# Altium schematic sheet MCU.SchDoc
size 250 x 219 mm; SheetNumber: 7; SheetTotal: 7; ENG_APP_DATE: --/--/--; DSN_APP_DATE: --/--/--; CHK_APP_DATE: --/--/--
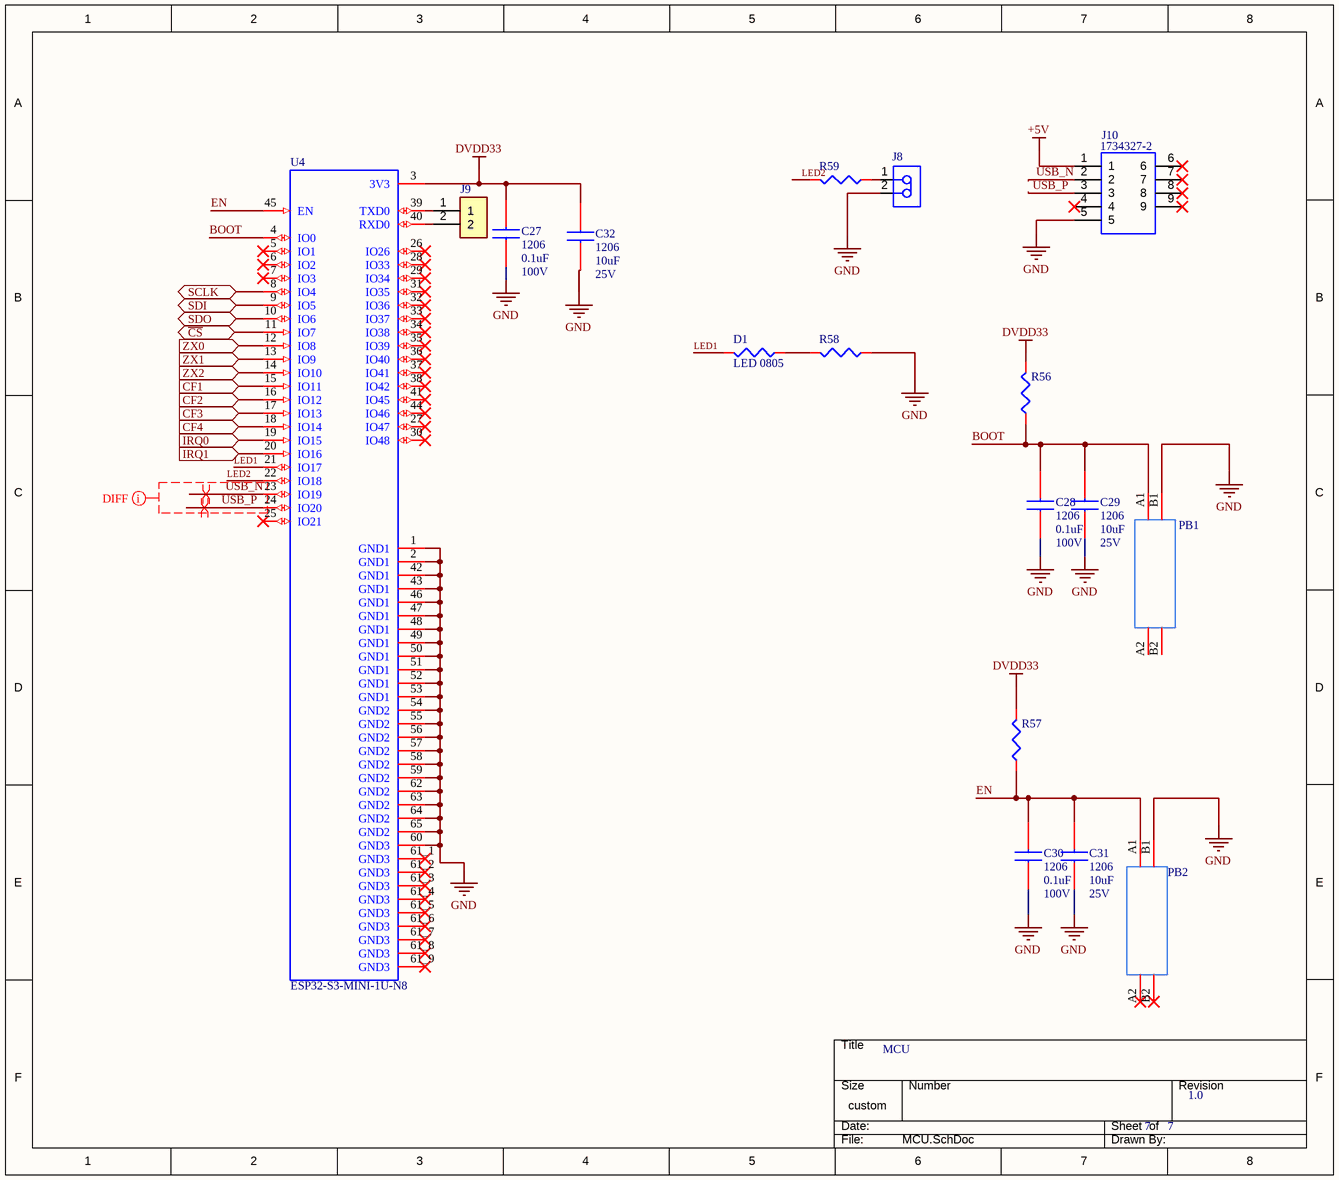
[diagram p0: MCU.SchDoc]

## Parts
C27  Size: 1206  Capacitance: 0.1uF  Voltage: 100V  [CAPC3316X180N]  (hidden comment: C1206C104J1RACAUTO)
C28  Size: 1206  Capacitance: 0.1uF  Voltage: 100V  [CAPC3316X180N]  (hidden comment: C1206C104J1RACAUTO)
C29  Size: 1206  Capacitance: 10uF  Voltage: 25V  [CAPC3316X180N]  (hidden comment: MBAST31LAB7106KTNA01)
C30  Size: 1206  Capacitance: 0.1uF  Voltage: 100V  [CAPC3316X180N]  (hidden comment: C1206C104J1RACAUTO)
C31  Size: 1206  Capacitance: 10uF  Voltage: 25V  [CAPC3316X180N]  (hidden comment: MBAST31LAB7106KTNA01)
C32  Size: 1206  Capacitance: 10uF  Voltage: 25V  [CAPC3316X180N]  (hidden comment: MBAST31LAB7106KTNA01)
D1  LED 0805  [RESC2013X84N]
J8  B2B-PH-K-S(LF)(SN)  [JST-B2B-PH-K-S_V]  (value not drawn)
J9  HTSW-102-07-G-S  [HDRV2W64P0X254_1X2_508X248X838P]  (value not drawn)
J10  1734327-2  [17343272]
PB1  EVP-BV2C3L000  [EVPBV2C3L000]  (value not drawn)
PB2  EVP-BV2C3L000  [EVPBV2C3L000]  (value not drawn)
R56  ERA-6AED102V  [RESC2013X84N]  (value not drawn)
R57  ERA-6AED102V  [RESC2013X84N]  (value not drawn)
R58  ERA-6AED102V  [RESC2013X84N]  (value not drawn)
R59  ERA-6AED102V  [RESC2013X84N]  (value not drawn)
U4  ESP32-S3-MINI-1U-N8  [XCVR_ESP32-S3-MINI-1U-N8]

## Ports
CF1 (in, see Main[1B], MeteringIC[1D]), CF2 (in, see Main[1B], MeteringIC[2C]), CF3 (in, see Main[1B], MeteringIC[2C]), CF4 (in, see Main[1B], MeteringIC[2C]), IRQ0 (in, see Main[1B], MeteringIC[2C]), IRQ1 (in, see Main[1A], MeteringIC[2C]), SCLK (bidir, see Main[1B], MeteringIC[2E]), SDI (bidir, see Main[1B], MeteringIC[2E]), SDO (bidir, see Main[1B], MeteringIC[2E]), ZX0 (in, see Main[1B], MeteringIC[2D]), ZX1 (in, see Main[1B], MeteringIC[2D]), ZX2 (in, see Main[1B], MeteringIC[2D]), ~{CS} (bidir, see Main[1B], MeteringIC[2E])

## Nets
+5V: J10.1
DVDD33: C27.1 C32.1 R56.1 R57.1 U4.3(3V3)
GND: C27.2 C28.2 C29.2 C30.2 C31.2 C32.2 J8.2 J10.5 PB1.B1(NO_1) PB2.B1(NO_1) R58.2 U4.1(GND1) U4.2(GND1) U4.42(GND1) U4.43(GND1) U4.46(GND1) U4.47(GND1) U4.48(GND1) U4.49(GND1) U4.50(GND1) U4.51(GND1) U4.52(GND1) U4.53(GND1) U4.54(GND2) U4.55(GND2) U4.56(GND2) U4.57(GND2) U4.58(GND2) U4.59(GND2) U4.60(GND3) U4.62(GND2) U4.63(GND2) U4.64(GND2) U4.65(GND2)
BOOT: C28.1 C29.1 PB1.A1(COM_1) R56.2 U4.4(IO0)
~{CS}: U4.11(IO7) ; port ~{CS}
CF1: U4.15(IO11) ; port CF1
CF2: U4.16(IO12) ; port CF2
CF3: U4.17(IO13) ; port CF3
CF4: U4.18(IO14) ; port CF4
EN: C30.1 C31.1 PB2.A1(COM_1) R57.2 U4.45(EN)
IRQ0: U4.19(IO15) ; port IRQ0
IRQ1: U4.20(IO16) ; port IRQ1
LED1: D1.1 U4.21(IO17)
LED2: R59.2 U4.22(IO18)
SCLK: U4.8(IO4) ; port SCLK
SDI: U4.9(IO5) ; port SDI
SDO: U4.10(IO6) ; port SDO
USB_N: J10.2 U4.23(IO19)
USB_P: J10.3 U4.24(IO20)
ZX0: U4.12(IO8) ; port ZX0
ZX1: U4.13(IO9) ; port ZX1
ZX2: U4.14(IO10) ; port ZX2
NetD1_2: D1.2 R58.1
NetJ8_1: J8.1 R59.1
NetJ9_1: J9.1 U4.39(TXD0)
NetJ9_2: J9.2 U4.40(RXD0)

Not connected (* = marked no-connect by the designer): J10 4* 6* 7* 8* 9*; PB1 A2(COM_2) B2(NO_2); PB2 A2(COM_2)* B2(NO_2)*; U4 5(IO1)* 6(IO2)* 7(IO3)* 25(IO21)* 26(IO26)* 27(IO47)* 28(IO33)* 29(IO34)* 30(IO48)* 31(IO35)* 32(IO36)* 33(IO37)* 34(IO38)* 35(IO39)* 36(IO40)* 37(IO41)* 38(IO42)* 41(IO45)* 44(IO46)* 61_1(GND3)* 61_2(GND3)* 61_3(GND3)* 61_4(GND3)* 61_5(GND3)* 61_6(GND3)* 61_7(GND3)* 61_8(GND3)* 61_9(GND3)*

## Layout directives
differential pair: USB_N, USB_P
net class DIFF: USB_N, USB_P

## Notes on the sheet
- MCU
- 7
- 1.0
- DWG. NO.
- REV.
- SHT.
- THIS DOCUMENT AND THE DATA DISCLOSED HEREIN OR HEREWITH IS THE PROPERTY OF ALTIUM LIMITED AND MAY BE FREELY DISTRIBUTED IN WHOLE. NO RIGHTS ARE RESERVED OR EXPRESS OR IMPLIED WARANTEE GIVEN.
- REVISION
- DESCRIPTION
- DATE
- APPROVED
- ENG:
- APPROVALS
- PROJECT
- DSN:
- CHK:
- REFERENCE DOCUMENTS
- PROJECT REVISION:
- TITLE
- DOCUMENT REVISION:
- DESIGN ITEM:
- BOM:
- FAB DWG:
- PCB DWG:
- ASSY DWG:
- SCALE:
- SIZE
- B
- CAGE CODE
- FILE NAME
- DWG NO.
- SHEET
- OF
- REV

## Library data of the parts
C27 C28 C30 = C1206X224KARACAUTO: Multilayer Ceramic Capacitors MLCC - SMD/SMT 100V 0.1uF X7R 1206 5% AEC-Q200; Manufacturer_Name: KEMET; Geometry.Height: 1.8mm; Mouser Part Number: 80-C1206X224KARAUTO; Mouser Price/Stock: https://www.mouser.co.uk/ProductDetail/KEMET/C1206X224KARACAUTO?qs=zW32dvEIR3ul9TqTUrs40g%3D%3D; Manufacturer_Part_Number: C1206X224KARACAUTO; Datasheet Link: https://search.kemet.com/component-documentation/download/specsheet/C1206X224KARACAUTO
C29 C31 C32 = C1206X224KARACAUTO: Multilayer Ceramic Capacitors MLCC - SMD/SMT 25V 10uF X7R 1206 10%; Manufacturer_Name: KEMET; Geometry.Height: 1.8mm; Mouser Part Number: 80-C1206X224KARAUTO; Mouser Price/Stock: https://www.mouser.co.uk/ProductDetail/KEMET/C1206X224KARACAUTO?qs=zW32dvEIR3ul9TqTUrs40g%3D%3D; Manufacturer_Part_Number: C1206X224KARACAUTO; Datasheet Link: https://search.kemet.com/component-documentation/download/specsheet/C1206X224KARACAUTO
D1 R56 R57 = ERA-6AED102V: Thin Film Resistors - SMD 0805 1000ohms 25ppm 0.5% AEC-Q200; Manufacturer_Name: Panasonic; Geometry.Height: 0.6mm; Datasheet Link: https://industrial.panasonic.com/cdbs/www-data/pdf/RDM0000/AOA0000C307.pdf; Manufacturer_Part_Number: ERA-6AED102V; Mouser Part Number: 667-ERA-6AED102V; Mouser Price/Stock: https://www.mouser.co.uk/ProductDetail/Panasonic/ERA-6AED102V?qs=MNPzkKEzRtTAvKH%252BuMqwyg%3D%3D
J8 = CMP-2000-05162-1: Male Header, Pitch 2 mm, 1 x 2 Position, Height 6 mm, Tail Length 3.4 mm, -25 to 85 degC, RoHS, Bulk; Manufacturer: JST; Pitch: 2mm; Style/Orientation: StraightHeader/Plug; No of Positions: 2; Datasheet Version: Nov-08; Datasheet URL: http://datasheet.octopart.com/B2B-PH-K-S%28LF%29%28SN%29-JST-datasheet-8324864.pdf; Manufacturer URL: http://www.jst.com/home2.html; Type: ShroudedHeader; Termination: Crimp
J9 = HTSW-102-07-G-S: Samtec, HTSW, 2 Way, 1 Row, Vertical Pin Header; Geometry.Height: 8.38mm; Mouser Part Number: 200-HTSW10207GS; Mouser Price/Stock: https://www.mouser.co.uk/ProductDetail/Samtec/HTSW-102-07-G-S?qs=FESYatJ8odI1BCBanfu%2FIg%3D%3D; Manufacturer_Name: SAMTEC; Manufacturer_Part_Number: HTSW-102-07-G-S; Datasheet Link: http://suddendocs.samtec.com/prints/htsw-xxx-xx-xxx-x-xx-xx-xx-mkt.pdf
J10 = 1734327-2: Body Features: Offset 0 MM; Manufacturer_Name: TE Connectivity; Geometry.Height: 4.14mm; Mouser Part Number: 571-1734327-2; Mouser Price/Stock: https://www.mouser.co.uk/ProductDetail/TE-Connectivity/1734327-2?qs=MP5IOa7hLjVR6N4sgEE7xA%3D%3D; Manufacturer_Part_Number: 1734327-2; Datasheet Link: https://www.te.com/commerce/DocumentDelivery/DDEController?Action=srchrtrv&DocNm=1734327&DocType=Customer+Drawing&DocLang=English&DocFormat=pdf&PartCntxt=1734327-2
PB1 PB2 = EVP-BV2C3L000: Tactile Switches 6.5mm 6.2mm SMD Op Force 1.6N; Manufacturer_Name: Panasonic; Geometry.Height: 4.5mm; Mouser Part Number: 667-EVP-BV2C3L000; Mouser Price/Stock: https://www.mouser.co.uk/ProductDetail/Panasonic/EVP-BV2C3L000?qs=MyNHzdoqoQLjk3IN4ali%252Bg%3D%3D; Manufacturer_Part_Number: EVP-BV2C3L000; Datasheet Link: https://media.digikey.com/pdf/Data%20Sheets/Panasonic%20Electronic%20Components/EVP-BV_Type_DS.pdf
R58 = ERA-6AED102V: Thin Film Resistors - SMD 0805 330ohms 25ppm 0.5% AEC-Q200; Manufacturer_Name: Panasonic; Geometry.Height: 0.6mm; Datasheet Link: https://industrial.panasonic.com/cdbs/www-data/pdf/RDM0000/AOA0000C307.pdf; Manufacturer_Part_Number: ERA-6AED102V; Mouser Part Number: 667-ERA-6AED102V; Mouser Price/Stock: https://www.mouser.co.uk/ProductDetail/Panasonic/ERA-6AED102V?qs=MNPzkKEzRtTAvKH%252BuMqwyg%3D%3D
R59 = ERA-6AED102V: 0805 330R; Manufacturer_Name: Panasonic; Geometry.Height: 0.6mm; Datasheet Link: https://industrial.panasonic.com/cdbs/www-data/pdf/RDM0000/AOA0000C307.pdf; Manufacturer_Part_Number: ERA-6AED102V; Mouser Part Number: 667-ERA-6AED102V; Mouser Price/Stock: https://www.mouser.co.uk/ProductDetail/Panasonic/ERA-6AED102V?qs=MNPzkKEzRtTAvKH%252BuMqwyg%3D%3D
U4 = ESP32-S3-MINI-1U-N8: Bluetooth, WiFi 802.11b/g/n, Bluetooth v5.0 Transceiver Module 2.4GHz Antenna Not Included, U.FL Surface Mount; MF: Espressif Systems; SnapEDA_Link: https://www.snapeda.com/parts/ESP32-S3-MINI-1U-N8/Espressif+Systems/view-part/?ref=snap; Package: VFQFN-56 Espressif Systems; Value: *; MP: ESP32-S3-MINI-1U-N8; Check_prices: https://www.snapeda.com/parts/ESP32-S3-MINI-1U-N8/Espressif+Systems/view-part/?ref=eda